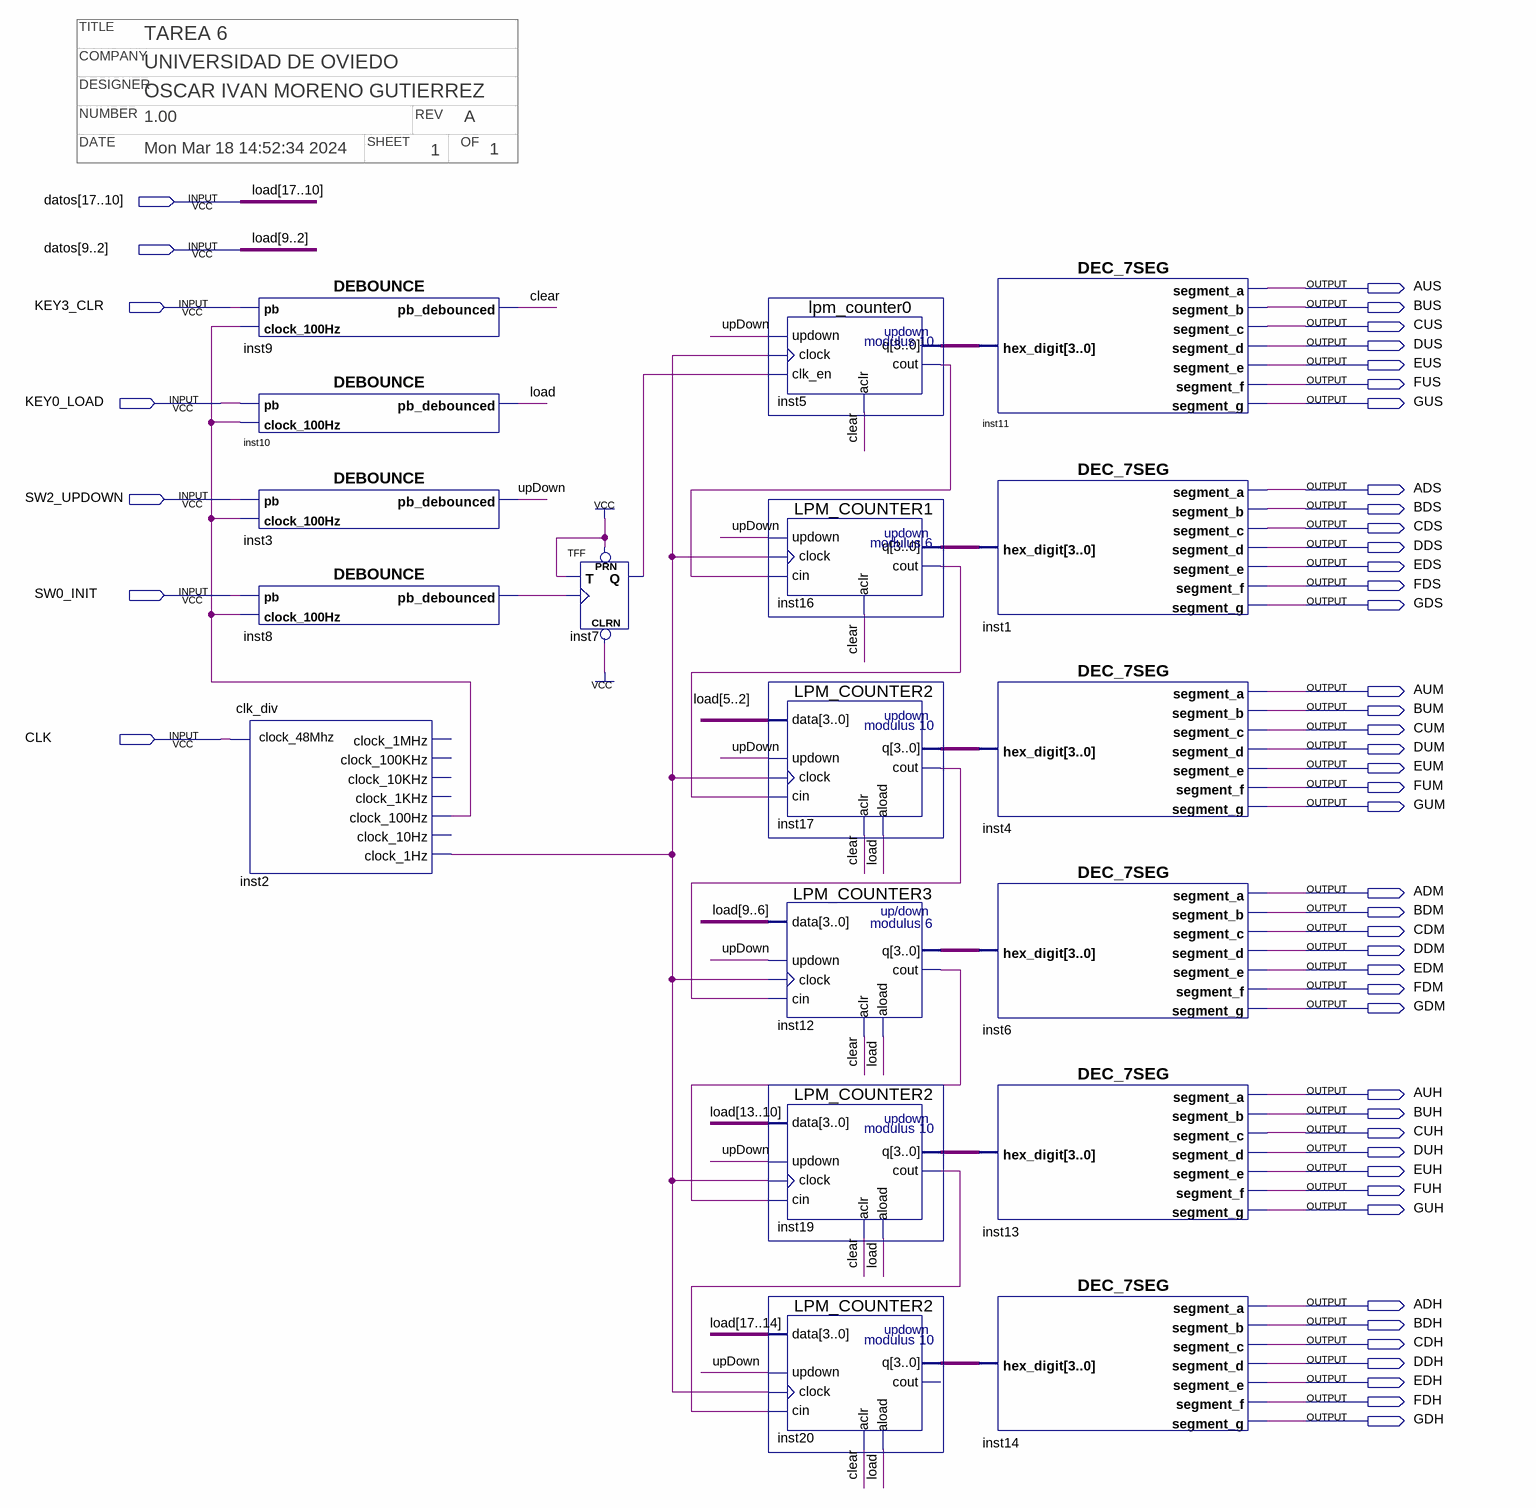
[diagram p0: schematic sheet]
// Quartus schematic tutor3.bdf as structural Verilog: 18 symbols, 49 pins
// Title block: COMPANY: UNIVERSIDAD DE OVIEDO; DATE: Mon Mar 18 14:52:34 2024; DESIGNER: OSCAR IVAN MORENO GUTIERREZ; NUMBER: 1.00; OF: 1; REV: A; SHEET: 1; TITLE: TAREA 6
module tutor3 (
  input  [17:2] datos,
  input  KEY3_CLR,
  input  KEY0_LOAD,
  input  SW2_UPDOWN,
  input  SW0_INIT,
  input  CLK,
  output AUS,
  output BUS,
  output CUS,
  output DUS,
  output EUS,
  output FUS,
  output GUS,
  output ADS,
  output BDS,
  output CDS,
  output DDS,
  output EDS,
  output FDS,
  output GDS,
  output AUM,
  output BUM,
  output CUM,
  output DUM,
  output EUM,
  output FUM,
  output GUM,
  output ADM,
  output BDM,
  output CDM,
  output DDM,
  output EDM,
  output FDM,
  output GDM,
  output AUH,
  output BUH,
  output CUH,
  output DUH,
  output EUH,
  output FUH,
  output GUH,
  output ADH,
  output BDH,
  output CDH,
  output DDH,
  output EDH,
  output FDH,
  output GDH
);

  wire clear, inst2_clock_1hz, inst2_clock_100hz, inst5_cout, inst7_q, inst8_pb_debounced, inst12_cout,
       inst16_cout, inst17_cout, inst19_cout, load, upDown;
  wire [3:0] inst5_q, inst12_q, inst16_q, inst17_q, inst19_q, inst20_q;

  DEBOUNCE inst9 (.pb(KEY3_CLR), .clock_100Hz(inst2_clock_100hz), .pb_debounced(clear));
  DEBOUNCE inst10 (.pb(KEY0_LOAD), .clock_100Hz(inst2_clock_100hz), .pb_debounced(load));
  DEBOUNCE inst3 (.pb(SW2_UPDOWN), .clock_100Hz(inst2_clock_100hz), .pb_debounced(upDown));
  DEBOUNCE inst8 (.pb(SW0_INIT), .clock_100Hz(inst2_clock_100hz), .pb_debounced(inst8_pb_debounced));
  clk_div inst2 (
    .clock_48Mhz(CLK), .clock_100Hz(inst2_clock_100hz), .clock_1Hz(inst2_clock_1hz));  // open: clock_1MHz, clock_100KHz, clock_10KHz, clock_1KHz, clock_10Hz
  TFF inst7 (.PRN(1'b1), .CLRN(1'b1), .T(1'b1), .CLK(inst8_pb_debounced), .Q(inst7_q));
  lpm_counter0 inst5 (
    .updown(upDown), .clock(inst2_clock_1hz), .clk_en(inst7_q), .aclr(clear), .cout(inst5_cout), .q(inst5_q));
  LPM_COUNTER1 inst16 (
    .updown(upDown), .clock(inst2_clock_1hz), .cin(inst5_cout), .aclr(clear), .cout(inst16_cout), .q(inst16_q));
  LPM_COUNTER2 inst17 (
    .data(datos[5:2]), .updown(upDown), .clock(inst2_clock_1hz), .cin(inst16_cout), .aclr(clear),
    .aload(load), .cout(inst17_cout), .q(inst17_q));
  LPM_COUNTER3 inst12 (
    .data(datos[9:6]), .updown(upDown), .clock(inst2_clock_1hz), .cin(inst17_cout), .aclr(clear),
    .aload(load), .q(inst12_q), .cout(inst12_cout));
  LPM_COUNTER2 inst19 (
    .data(datos[13:10]), .updown(upDown), .clock(inst2_clock_1hz), .cin(inst12_cout), .aclr(clear),
    .aload(load), .cout(inst19_cout), .q(inst19_q));
  LPM_COUNTER2 inst20 (
    .data(datos[17:14]), .updown(upDown), .clock(inst2_clock_1hz), .cin(inst19_cout), .aclr(clear),
    .aload(load), .q(inst20_q));  // open: cout
  DEC_7SEG inst11 (
    .hex_digit(inst5_q), .segment_a(AUS), .segment_b(BUS), .segment_c(CUS), .segment_d(DUS), .segment_e(EUS),
    .segment_f(FUS), .segment_g(GUS));
  DEC_7SEG inst1 (
    .hex_digit(inst16_q), .segment_a(ADS), .segment_b(BDS), .segment_c(CDS), .segment_d(DDS),
    .segment_e(EDS), .segment_f(FDS), .segment_g(GDS));
  DEC_7SEG inst4 (
    .hex_digit(inst17_q), .segment_a(AUM), .segment_b(BUM), .segment_c(CUM), .segment_d(DUM),
    .segment_e(EUM), .segment_f(FUM), .segment_g(GUM));
  DEC_7SEG inst6 (
    .hex_digit(inst12_q), .segment_a(ADM), .segment_b(BDM), .segment_c(CDM), .segment_d(DDM),
    .segment_e(EDM), .segment_f(FDM), .segment_g(GDM));
  DEC_7SEG inst13 (
    .hex_digit(inst19_q), .segment_a(AUH), .segment_b(BUH), .segment_c(CUH), .segment_d(DUH),
    .segment_e(EUH), .segment_f(FUH), .segment_g(GUH));
  DEC_7SEG inst14 (
    .hex_digit(inst20_q), .segment_a(ADH), .segment_b(BDH), .segment_c(CDH), .segment_d(DDH),
    .segment_e(EDH), .segment_f(FDH), .segment_g(GDH));

  // Other names for the same wires on the sheet: load[17:2] = datos
endmodule
